# EAGLE schematic DZ60_Demoboard_V10_DLN18703 (EAGLE 9.6.2)

## Sheet 1 of 3
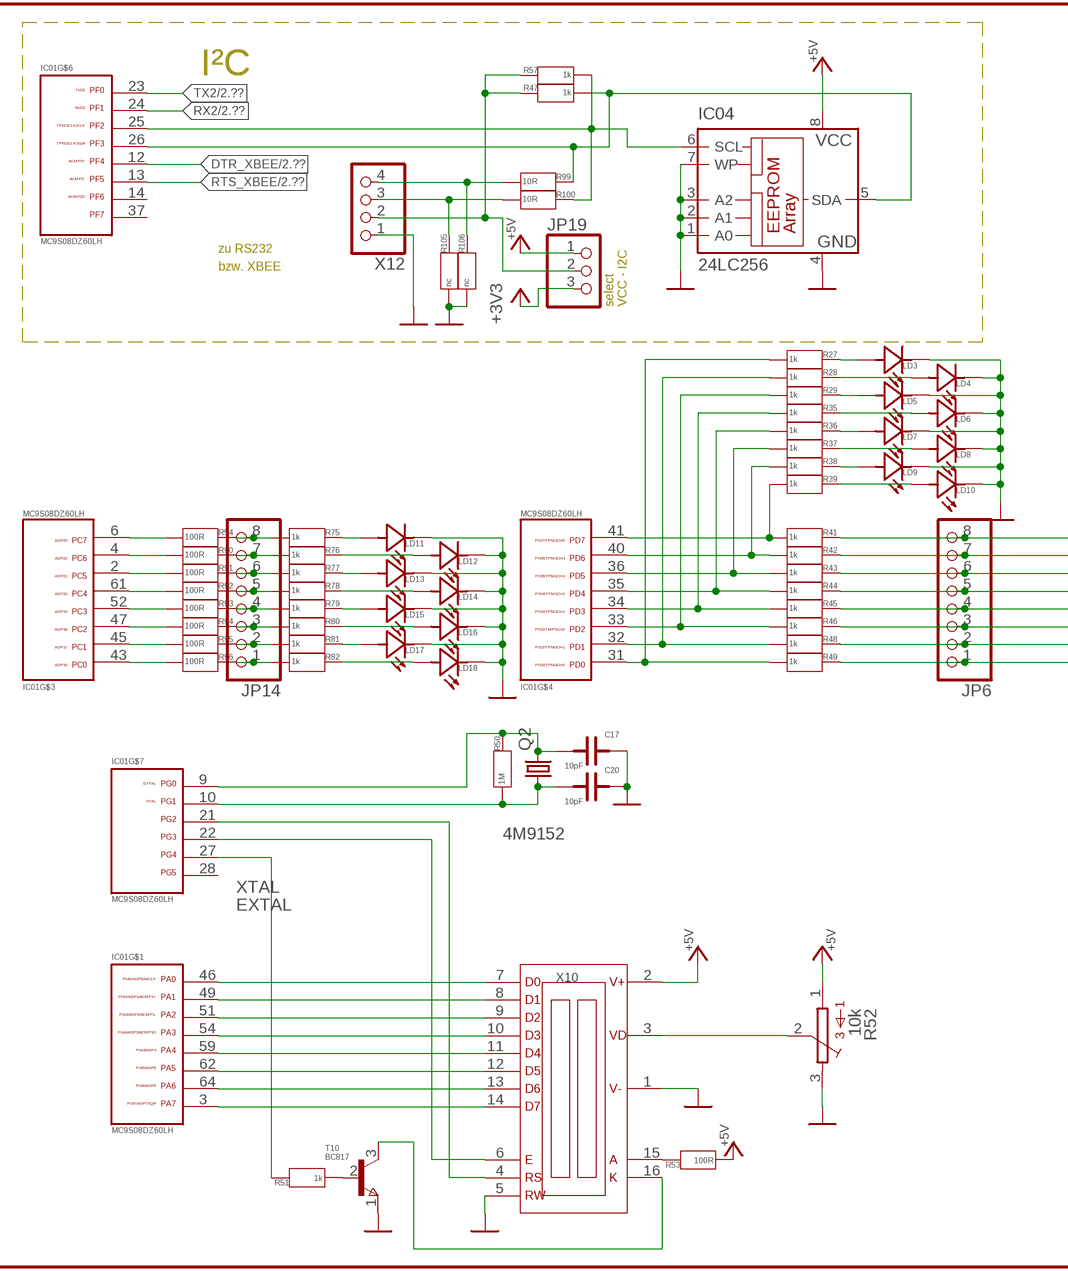
[diagram p0: schematic, sheet 1, part 1 of 2]
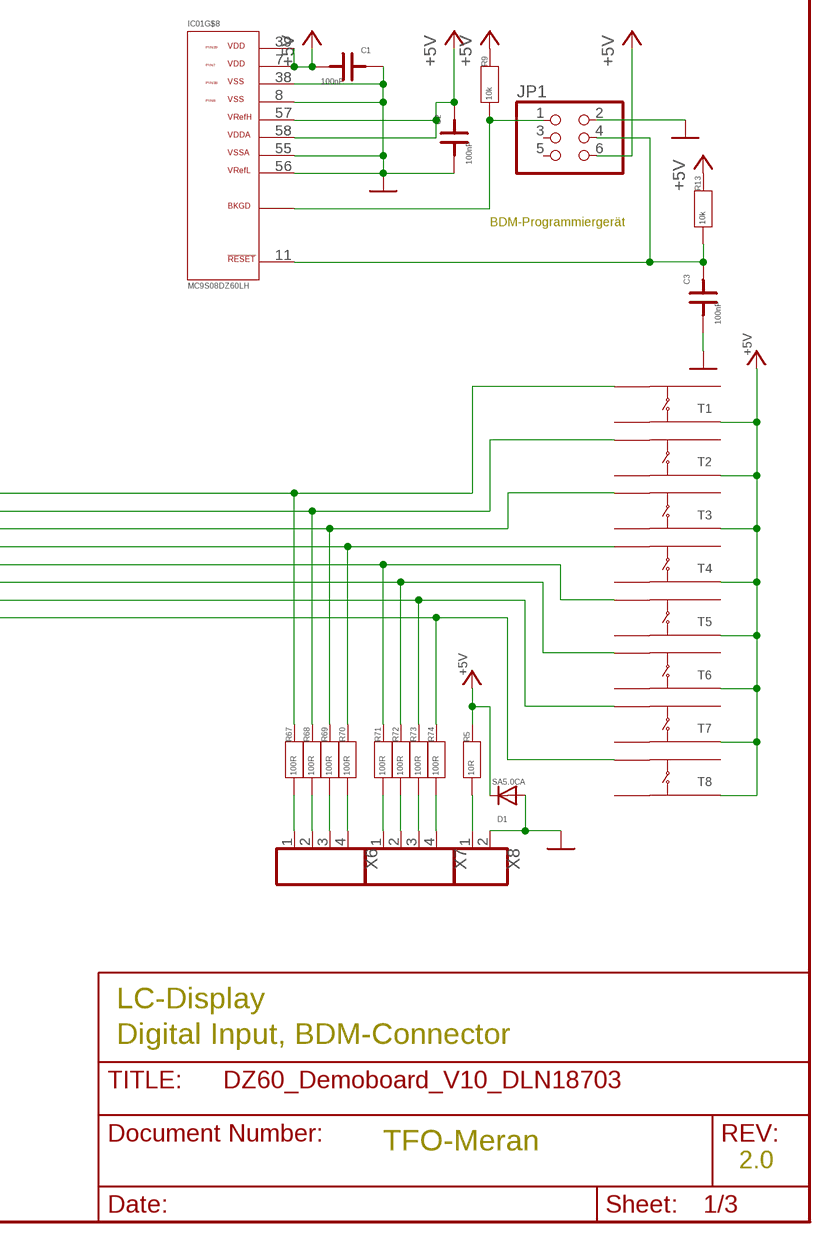
[diagram p1: schematic, sheet 1, part 2 of 2]

### Parts
C1  100nF  C1  [0805F]
C2  100nF  C1  [0805F]
C3  100nF  C1  [0805F]
C17  10pF  C1  [0805F]
C20  10pF  C1  [0805F]
D1  SA5.0CA  DIODE-SMB  [SMB]
IC01  MC9S08DZ60LH  [LQFP64]
IC04  24LC256  24CLC256SM  [SO-08M]
JP1  PINHD-2X3  [2X03]
JP6  PINHD-1X8  [1X08]
JP14  PINHD-1X8  [1X08]
JP19  PINHD-1X3  [1X03]
LD3  LEDSMD  [0805LED]
LD4  LEDSMD  [0805LED]
LD5  LEDSMD  [0805LED]
LD6  LEDSMD  [0805LED]
LD7  LEDSMD  [0805LED]
LD8  LEDSMD  [0805LED]
LD9  LEDSMD  [0805LED]
LD10  LEDSMD  [0805LED]
LD11  LEDSMD  [0805LED]
LD12  LEDSMD  [0805LED]
LD13  LEDSMD  [0805LED]
LD14  LEDSMD  [0805LED]
LD15  LEDSMD  [0805LED]
LD16  LEDSMD  [0805LED]
LD17  LEDSMD  [0805LED]
LD18  LEDSMD  [0805LED]
Q2  4M9152  HC49UP  [HC49UP]
R5  10R  R1  [0805]
R9  10k  R1  [0805]
R13  10k  R1  [0805]
R27  1k  R1  [0805]
R28  1k  R1  [0805]
R29  1k  R1  [0805]
R35  1k  R1  [0805]
R36  1k  R1  [0805]
R37  1k  R1  [0805]
R38  1k  R1  [0805]
R39  1k  R1  [0805]
R41  1k  R1  [0805]
R42  1k  R1  [0805]
R43  1k  R1  [0805]
R44  1k  R1  [0805]
R45  1k  R1  [0805]
R46  1k  R1  [0805]
R47  1k  R1  [0805]
R48  1k  R1  [0805]
R49  1k  R1  [0805]
R50  1M  R1  [0805]
R51  1k  R1  [0805]
R52  10k  S63X  [S63X]
R53  100R  R1  [0805]
R54  100R  R1  [0805]
R57  1k  R1  [0805]
R67  100R  R1  [0805]
R68  100R  R1  [0805]
R69  100R  R1  [0805]
R70  100R  R1  [0805]
R71  100R  R1  [0805]
R72  100R  R1  [0805]
R73  100R  R1  [0805]
R74  100R  R1  [0805]
R75  1k  R1  [0805]
R76  1k  R1  [0805]
R77  1k  R1  [0805]
R78  1k  R1  [0805]
R79  1k  R1  [0805]
R80  1k  R1  [0805]
R81  1k  R1  [0805]
R82  1k  R1  [0805]
R90  100R  R1  [0805]
R91  100R  R1  [0805]
R92  100R  R1  [0805]
R93  100R  R1  [0805]
R94  100R  R1  [0805]
R95  100R  R1  [0805]
R96  100R  R1  [0805]
R99  10R  R1  [0805]
R100  10R  R1  [0805]
R105  nc  R1  [0805]
R106  nc  R1  [0805]
T1  TASTERTHT  [TASTE_THT]
T2  TASTERTHT  [TASTE_THT]
T3  TASTERTHT  [TASTE_THT]
T4  TASTERTHT  [TASTE_THT]
T5  TASTERTHT  [TASTE_THT]
T6  TASTERTHT  [TASTE_THT]
T7  TASTERTHT  [TASTE_THT]
T8  TASTERTHT  [TASTE_THT]
T10  BC817  [SOT-23]
X6  KLEMME4  [KLEMME4]
X7  KLEMME4  [KLEMME4]
X8  KLEMME2  [KLEMME2]
X10  FDCC1602G  [FDCC1602G]
X12  MX254_4  [MX4]

### Nets
+3V3: JP19.3 ; also sheet 2,3
+5V: C1.1 C2.2 D1.C IC01.7(VDD_PIN7) IC01.39(VDD_PIN39) IC01.57(VREFH) IC01.58(VDDA) IC04.8(VCC) JP1.6 JP19.1 R5.2 R9.2 R13.2 R52.1 R53.1 T1.A1 T2.A1 T3.A1 T4.A1 T5.A1 T6.A1 T7.A1 T8.A1 X10.2(V+) ; also sheet 2,3
BKGD: IC01.42(BKGD) JP1.1 R9.1
D0: IC01.46(PA0) X10.7(D0)
D1: IC01.49(PA1) X10.8(D1)
D2: IC01.51(PA2) X10.9(D2)
D3: IC01.54(PA3) X10.10(D3)
D4: IC01.59(PA4) X10.11(D4)
D5: IC01.62(PA5) X10.12(D5)
D6: IC01.64(PA6) X10.13(D6)
D7: IC01.3(PA7) X10.14(D7)
DTR_XBEE: IC01.12(PF4) ; also sheet 2
E: IC01.22(PG3) X10.6(E)
EXTAL: C20.1 IC01.10(PG1) Q2.1 R50.1
GND: C1.2 C2.1 C3.1 C17.2 C20.2 D1.A IC01.8(VSS_PIN8) IC01.38(VSS_PIN38) IC01.55(VSSA) IC01.56(VREFL) IC04.1(A0) IC04.2(A1) IC04.3(A2) IC04.4(GND) IC04.7(WP) JP1.2 LD3.K LD4.K LD5.K LD6.K LD7.K LD8.K LD9.K LD10.K LD11.K LD12.K LD13.K LD14.K LD15.K LD16.K LD17.K LD18.K R52.3 R105.1 R106.1 T10.1(E) X8.2 X10.1(V-) X10.5(RW) X12.1 ; also sheet 2,3
LCD_LED1: IC01.27(PG4) R51.2
N$1: R53.2 X10.15(A)
N$14: LD11.A R75.2
N$15: LD12.A R76.2
N$24: LD3.A R27.2
N$25: LD4.A R28.2
N$26: LD5.A R29.2
N$27: LD6.A R35.2
N$29: LD7.A R36.2
N$31: LD8.A R37.2
N$32: LD9.A R38.2
N$33: LD10.A R39.2
N$39: R51.1 T10.2(B)
N$43: R5.1 X8.1
N$67: R52.2 X10.3(VD)
N$68: T10.3(C) X10.16(K)
N$72: LD13.A R77.2
N$73: LD14.A R78.2
N$74: LD15.A R79.2
N$75: LD16.A R80.2
N$76: LD17.A R81.2
N$77: LD18.A R82.2
PC0: JP14.1 R82.1 R96.2
PC0M: IC01.43(PC0) R96.1
PC1: JP14.2 R81.1 R95.2
PC1M: IC01.45(PC1) R95.1
PC2: JP14.3 R80.1 R94.2
PC2M: IC01.47(PC2) R94.1
PC3: JP14.4 R79.1 R93.2
PC3M: IC01.52(PC3) R93.1
PC4: JP14.5 R78.1 R92.2
PC4M: IC01.61(PC4) R92.1
PC5: JP14.6 R77.1 R91.2
PC5M: IC01.2(PC5) R91.1
PC6: JP14.7 R76.1 R90.2
PC6M: IC01.4(PC6) R90.1
PC7: JP14.8 R54.2 R75.1
PC7M: IC01.6(PC7) R54.1
PD0: JP6.1 R49.2 R74.2 T8.B2
PD0M: IC01.31(PD0) R27.1 R49.1
PD1: JP6.2 R48.2 R73.2 T7.B2
PD1M: IC01.32(PD1) R28.1 R48.1
PD2: JP6.3 R46.2 R72.2 T6.B2
PD2M: IC01.33(PD2) R29.1 R46.1
PD3: JP6.4 R45.2 R71.2 T5.B2
PD3M: IC01.34(PD3) R35.1 R45.1
PD4: JP6.5 R44.2 R70.2 T4.B2
PD4M: IC01.35(PD4) R36.1 R44.1
PD5: JP6.6 R43.2 R69.2 T3.B2
PD5M: IC01.36(PD5) R37.1 R43.1
PD6: JP6.7 R42.2 R68.2 T2.B2
PD6M: IC01.40(PD6) R38.1 R42.1
PD7: JP6.8 R41.2 R67.2 T1.B2
PD7M: IC01.41(PD7) R39.1 R41.1
PF0A: R74.1 X7.4
PF1A: R73.1 X7.3
PF2A: R72.1 X7.2
PF3A: R71.1 X7.1
PF4A: R70.1 X6.4
PF5A: R69.1 X6.3
PF6A: R68.1 X6.2
PF7A: R67.1 X6.1
RESET: C3.2 IC01.11(RST/) JP1.4 R13.1
RS: IC01.21(PG2) X10.4(RS)
RTS_XBEE: IC01.13(PF5) ; also sheet 2
RX2: IC01.24(PF1) ; also sheet 2
SCL_PF2: IC01.25(PF2) IC04.6(SCL) R57.1 R100.2
SCL_PIN: R100.1 R105.2 X12.3
SDA_PF3: IC01.26(PF3) IC04.5(SDA) R47.1 R99.2
SDA_PIN: R99.1 R106.2 X12.4
TX2: IC01.23(PF0) ; also sheet 2
U_I2C: JP19.2 R47.2 R57.2 X12.2
XTAL: C17.1 IC01.9(PG0) Q2.2 R50.2
Unconnected: IC01.14(PF6) IC01.28(PG5) IC01.37(PF7) JP1.3 JP1.5 T1.A2 T1.B1 T2.A2 T2.B1 T3.A2 T3.B1 T4.A2 T4.B1 T5.A2 T5.B1 T6.A2 T6.B1 T7.A2 T7.B1 T8.A2 T8.B1

### Notes on the sheet
- I²C
- zu RS232
- bzw. XBEE | BDM-Programmiergerät
- select | VCC - I2C
- LC-Display
- Digital Input, BDM-Connector
- TFO-Meran
- 2.0

## Sheet 2 of 3
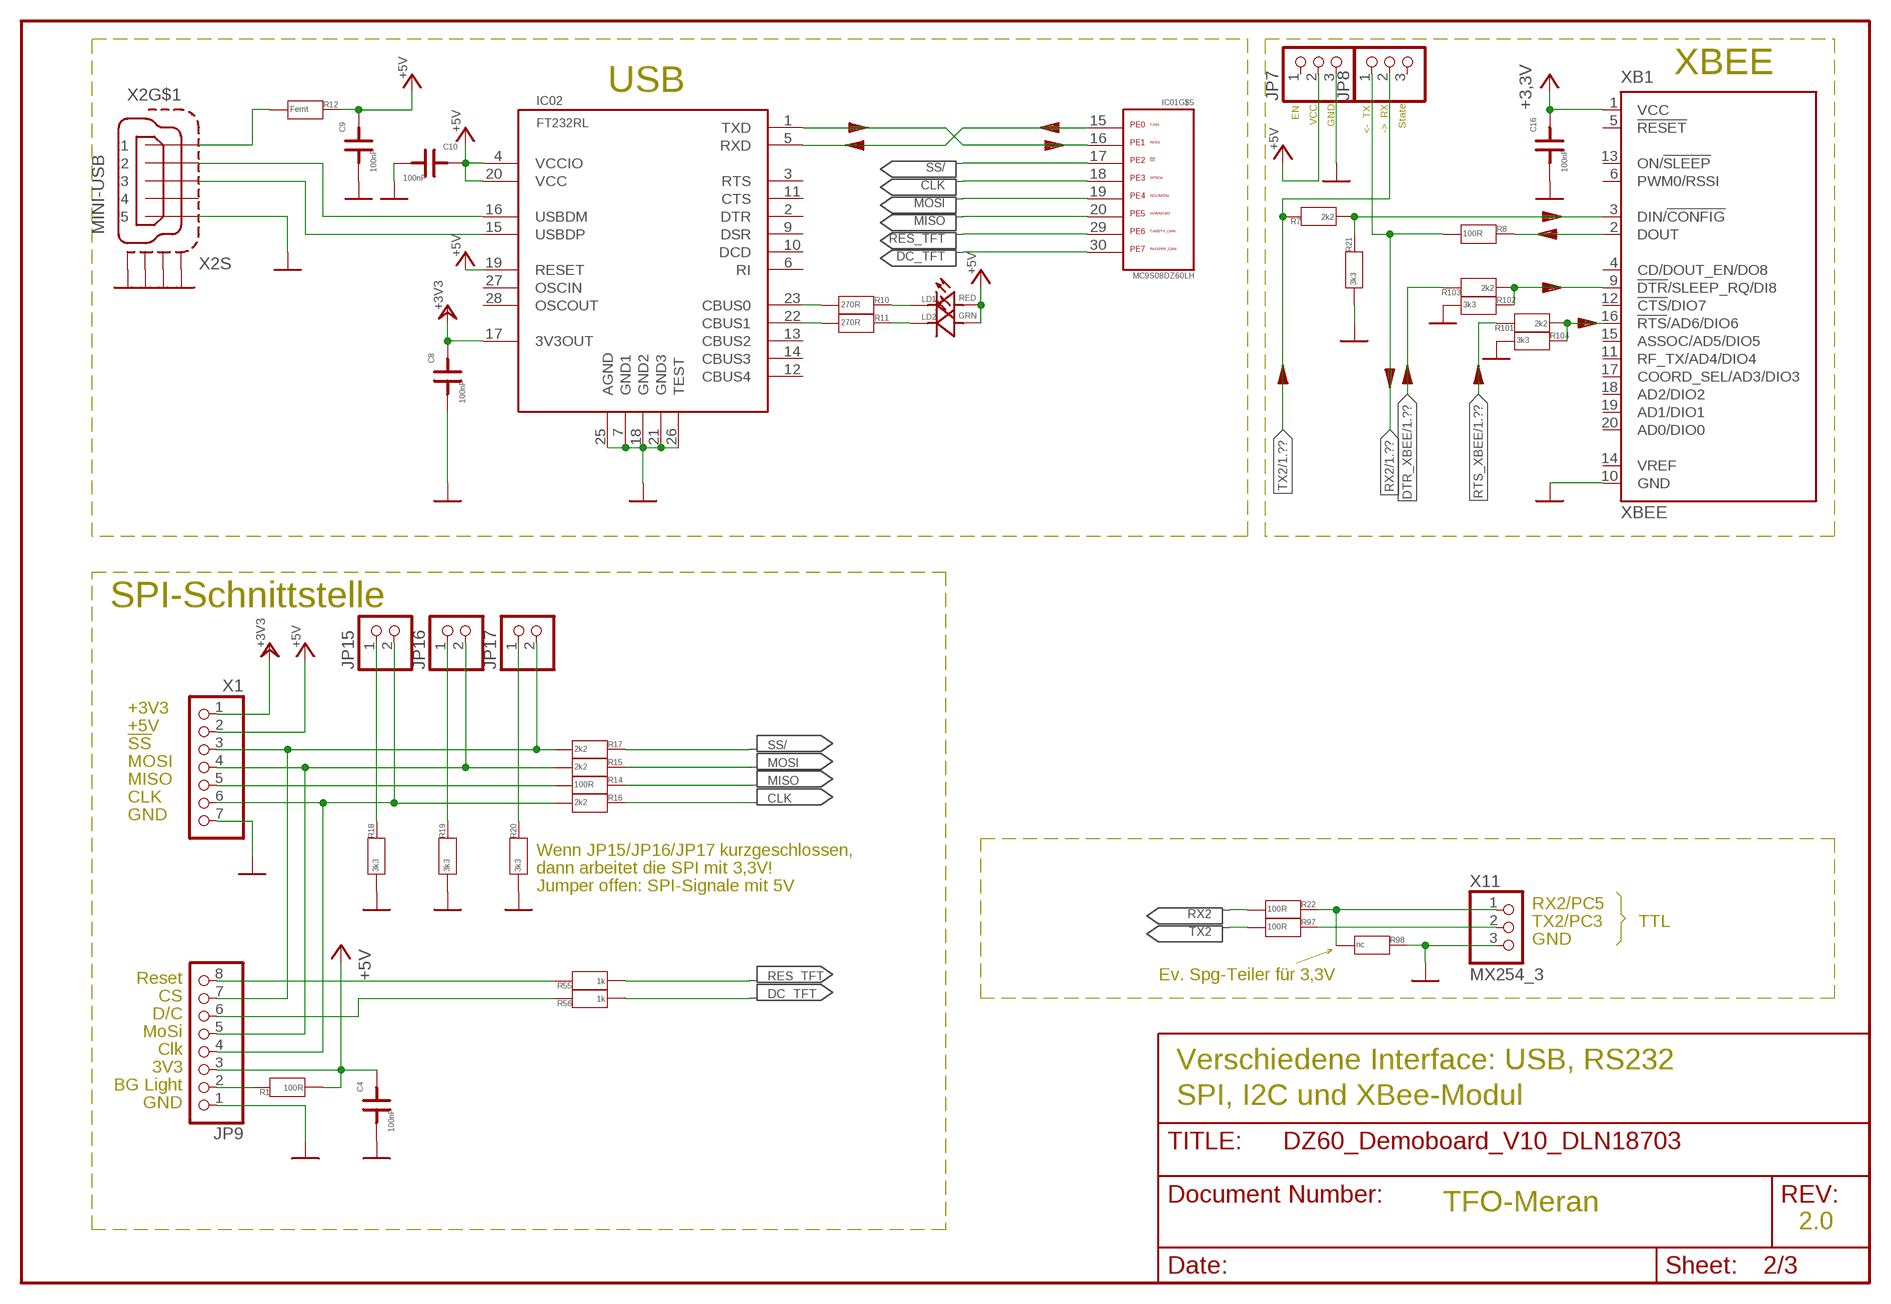
[diagram p2: schematic, sheet 2]

### Parts
C4  100nF  C1  [0805F]
C8  100nF  C1  [0805F]
C9  100nF  C1  [0805F]
C10  100nF  C1  [0805F]
C16  100nF  C1  [0805F]
IC02  FT232RL  FTDI232RL  [SSOP28]
JP7  PINHD-1X3  [1X03]
JP8  PINHD-1X3  [1X03]
JP9  PINHD-1X8  [1X08]
JP15  PINHD-1X2  [1X02]
JP16  PINHD-1X2  [1X02]
JP17  PINHD-1X2  [1X02]
LD1  RED  LEDSMD  [0805LED]
LD2  GRN  LEDSMD  [0805LED]
R1  100R  R1  [0805]
R7  2k2  R1  [0805]
R8  100R  R1  [0805]
R10  270R  R1  [0805]
R11  270R  R1  [0805]
R12  Ferrit  R2  [1206]
R14  100R  R1  [0805]
R15  2k2  R1  [0805]
R16  2k2  R1  [0805]
R17  2k2  R1  [0805]
R18  3k3  R1  [0805]
R19  3k3  R1  [0805]
R20  3k3  R1  [0805]
R21  3k3  R1  [0805]
R22  100R  R1  [0805]
R55  1k  R1  [0805]
R56  1k  R1  [0805]
R97  100R  R1  [0805]
R98  nc  R1  [0805]
R101  2k2  R1  [0805]
R102  3k3  R1  [0805]
R103  2k2  R1  [0805]
R104  3k3  R1  [0805]
X1  MX254_7  [MX7]
X2  MINI-USB  MINI-USB-SCHIELD-32005-201  [32005-201]
X11  MX254_3  [MX3]
XB1  XBEE  [XBEE]

### Nets
+3V3: C8.2 C16.2 IC02.17(3V3OUT) X1.1 XB1.1(VCC) ; supply symbol labelled +3,3V ; also sheet 1,3
+5V: C4.2 C9.2 C10.2 IC02.4(VCCIO) IC02.19(RESET) IC02.20(VCC) JP7.2 JP9.3 LD1.A LD2.A R1.1 R12.2 X1.2 ; also sheet 1,3
CLK: IC01.18(PE3) R16.2
DC_TFT: IC01.30(PE7) R56.1
DTR_XBEE: R103.2 ; also sheet 1
GND: C4.1 C8.1 C9.1 C10.1 C16.1 IC02.7(GND1) IC02.18(GND2) IC02.21(GND3) IC02.25(AGND) IC02.26(TEST) JP7.3 JP9.1 R18.1 R19.1 R20.1 R21.1 R98.2 R102.1 R104.1 X1.7 X2.5 X2.M1(S:S1) X2.M2(S:S2) X2.M3(S:S3) X2.M4(S:S4) X11.3 XB1.10(GND) ; also sheet 1,3
MISO: IC01.20(PE5) R14.2
MOSI: IC01.19(PE4) R15.2
N$2: LD1.K R10.2
N$3: R14.1 X1.5
N$5: IC02.23(CBUS0) R10.1
N$6: LD2.K R11.2
N$7: IC02.22(CBUS1) R11.1
N$13: JP9.8 R55.2
N$22: JP9.2 R1.2
N$28: JP9.4 JP15.2 R16.1 X1.6
N$30: JP9.7 JP17.2 R17.1 X1.3
N$35: JP9.6 R56.2
N$36: JP17.1 R20.2
N$37: JP16.1 R19.2
N$50: JP15.1 R18.2
N$51: JP9.5 JP16.2 R15.1 X1.4
N$78: R8.2 XB1.2(DOUT)
N$81: R7.1 R21.2 XB1.3(DIN/!CONFIG)
N$82: R101.1 R104.2 XB1.16(!RTS!/AD6/DIO6)
N$85: R102.2 R103.1 XB1.9(!DTR!/SLEEP_RQ/DI8)
RES_TFT: IC01.29(PE6) R55.1
RTS_XBEE: R101.2 ; also sheet 1
RX1: IC01.16(PE1) IC02.1(TXD)
RX2: JP8.1 R8.1 R22.1 ; also sheet 1
RX2_PINHEAD: R22.2 R98.1 X11.1
SS/: IC01.17(PE2) R17.2
TX1: IC01.15(PE0) IC02.5(RXD)
TX2: JP8.2 R7.2 R97.1 ; also sheet 1
TX2_PINHEAD: R97.2 X11.2
USB_1: R12.1 X2.1
USB_2: IC02.16(USBDM) X2.2
USB_3: IC02.15(USBDP) X2.3
Unconnected: IC02.2(DTR) IC02.3(RTS) IC02.6(RI) IC02.9(DSR) IC02.10(DCD) IC02.11(CTS) IC02.12(CBUS4) IC02.13(CBUS2) IC02.14(CBUS3) IC02.27(OSCIN) IC02.28(OSCOUT) JP7.1 JP8.3 X2.4 XB1.4(CD/DOUT_EN/DO8) XB1.5(!RESET) XB1.6(PWM0/RSSI) XB1.11(RF_TX/AD4/DIO4) XB1.12(!CTS!/DIO7) XB1.13(ON/!SLEEP) XB1.14(VREF) XB1.15(ASSOC/AD5/DIO5) XB1.17(COORD_SEL/AD3/DIO3) XB1.18(AD2/DIO2) XB1.19(AD1/DIO1) XB1.20(AD0/DIO0)

### Notes on the sheet
- XBEE
- USB
- EN | VCC | GND | <-  TX | ->  RX | State
- SPI-Schnittstelle
- +3V3
- +5V
- !SS
- MOSI
- MISO
- CLK
- GND
- Wenn JP15/JP16/JP17 kurzgeschlossen,
- dann arbeitet die SPI mit 3,3V!
- Jumper offen: SPI-Signale mit 5V
- RX2/PC5
- TX2/PC3 | TTL
- GND
- Reset | Ev. Spg-Teiler für 3,3V
- CS
- D/C
- MoSi
- Clk
- 3V3 | Verschiedene Interface: USB, RS232
- BG Light
- GND | SPI, I2C und XBee-Modul
- TFO-Meran
- 2.0

## Sheet 3 of 3
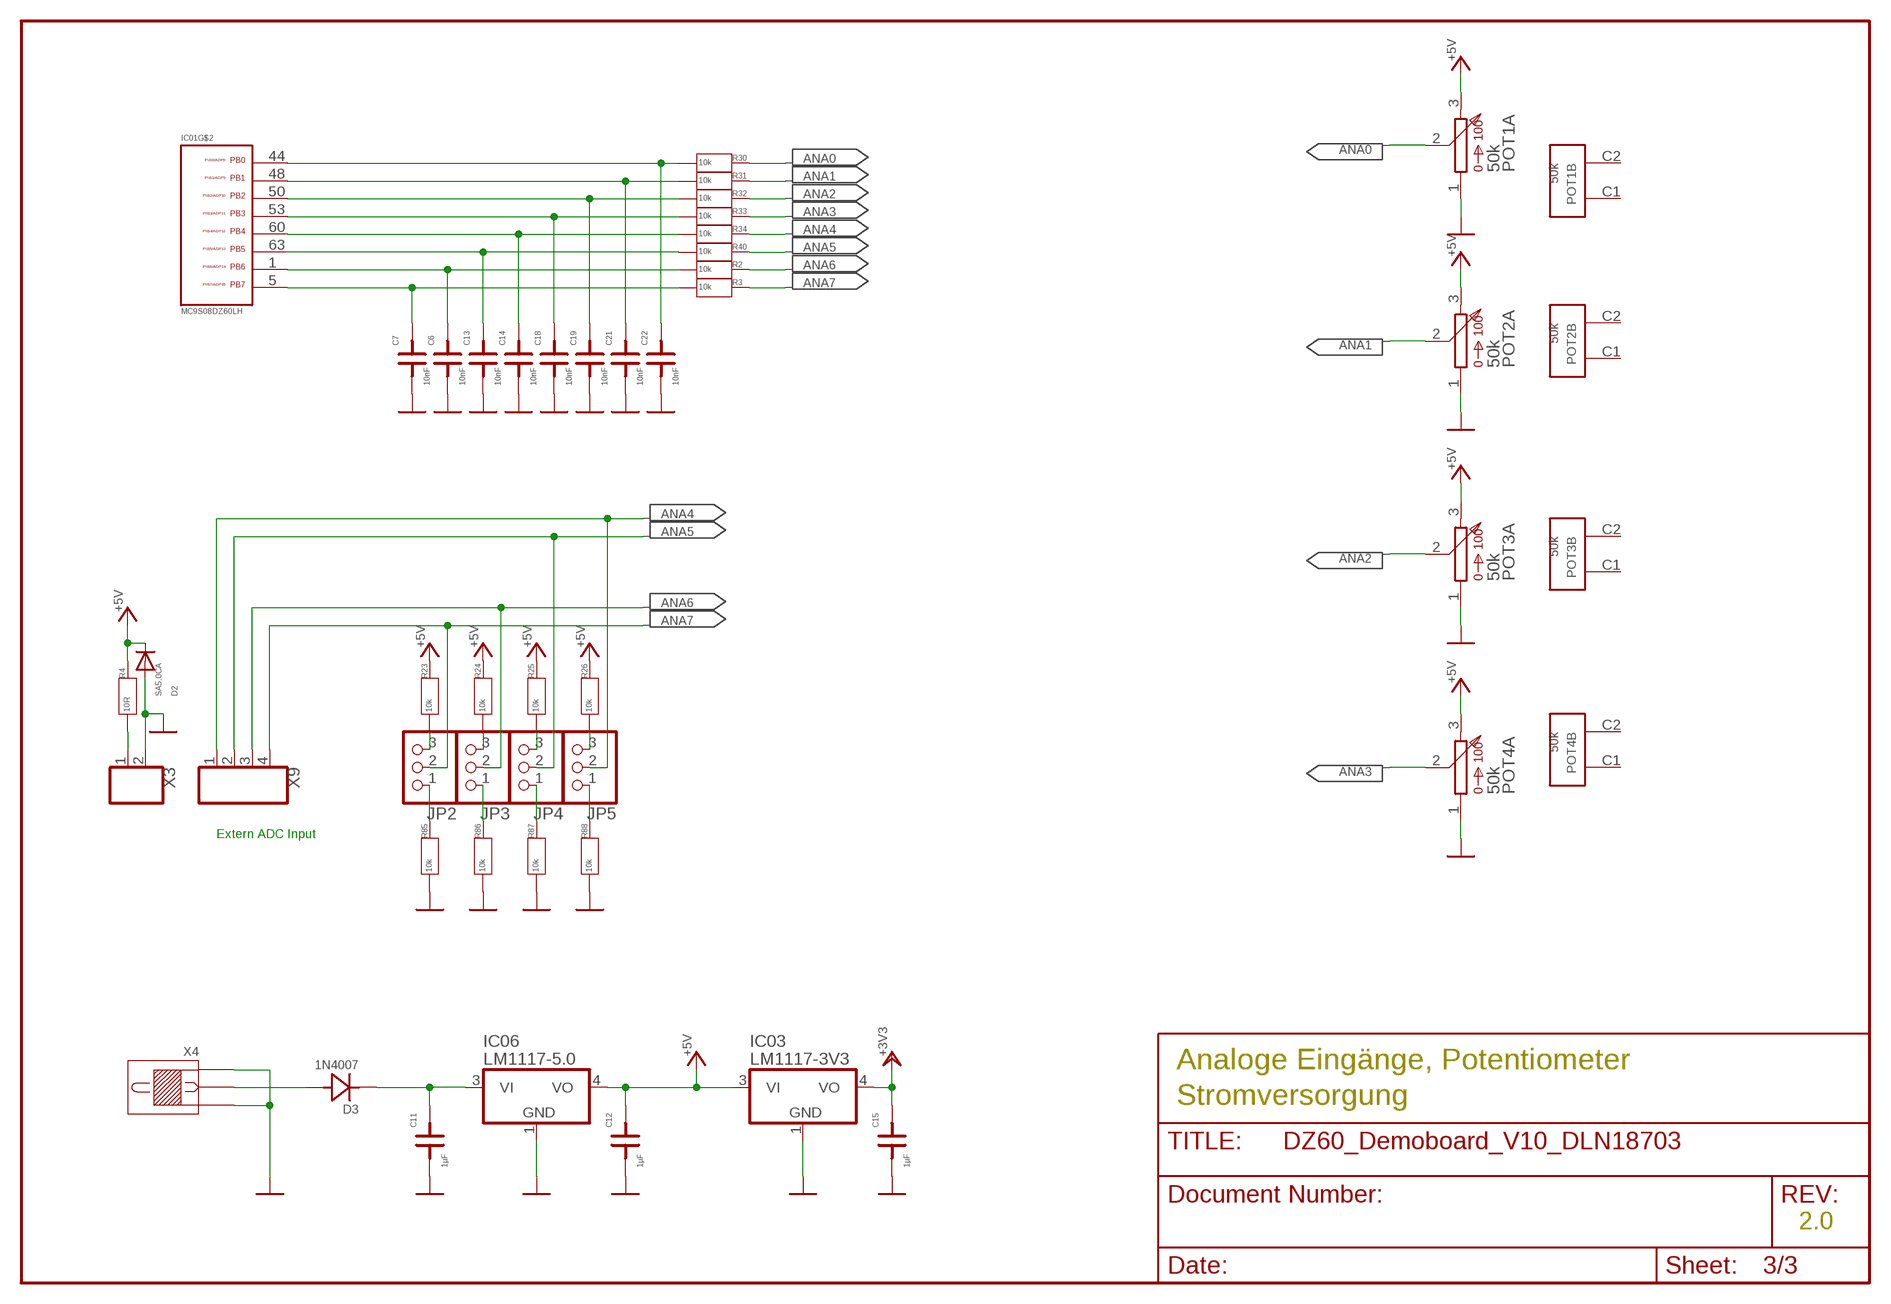
[diagram p3: schematic, sheet 3]

### Parts
C6  10nF  C1  [0805F]
C7  10nF  C1  [0805F]
C11  1µF  C1  [0805F]
C12  1µF  C1  [0805F]
C13  10nF  C1  [0805F]
C14  10nF  C1  [0805F]
C15  1µF  C1  [0805F]
C18  10nF  C1  [0805F]
C19  10nF  C1  [0805F]
C21  10nF  C1  [0805F]
C22  10nF  C1  [0805F]
D2  SA5.0CA  DIODE-SMB  [SMB]
D3  1N4007  DHCMELF  [MELF_B]
IC03  LM1117-3V3  LM1117DT  [DPAK]
IC06  LM1117-5.0  LM1117DT  [DPAK]
JP2  PINHD-1X3  [1X03]
JP3  PINHD-1X3  [1X03]
JP4  PINHD-1X3  [1X03]
JP5  PINHD-1X3  [1X03]
POT1  50k  ALPSVERT  [ALPS_VERTICAL]
POT2  50k  ALPSVERT  [ALPS_VERTICAL]
POT3  50k  ALPSVERT  [ALPS_VERTICAL]
POT4  50k  ALPSVERT  [ALPS_VERTICAL]
R2  10k  R1  [0805]
R3  10k  R1  [0805]
R4  10R  R1  [0805]
R23  10k  R1  [0805]
R24  10k  R1  [0805]
R25  10k  R1  [0805]
R26  10k  R1  [0805]
R30  10k  R1  [0805]
R31  10k  R1  [0805]
R32  10k  R1  [0805]
R33  10k  R1  [0805]
R34  10k  R1  [0805]
R40  10k  R1  [0805]
R85  10k  R1  [0805]
R86  10k  R1  [0805]
R87  10k  R1  [0805]
R88  10k  R1  [0805]
X3  KLEMME2  [KLEMME2]
X4  SPP  [SPP]
X9  KLEMME4  [KLEMME4]

### Nets
+3V3: C15.2 IC03.4(VO) ; also sheet 1,2
+5V: C12.2 D2.C IC03.3(VI) IC06.4(VO) POT1.3 POT2.3 POT3.3 POT4.3 R4.2 R23.2 R24.2 R25.2 R26.2 ; also sheet 1,2
ADCPB0: C22.2 IC01.44(PB0) R30.1
ADCPB1: C21.2 IC01.48(PB1) R31.1
ADCPB2: C19.2 IC01.50(PB2) R32.1
ADCPB3: C18.2 IC01.53(PB3) R33.1
ADCPB4: C14.2 IC01.60(PB4) R34.1
ADCPB5: C13.2 IC01.63(PB5) R40.1
ADCPB6: C6.2 IC01.1(PB6) R2.1
ADCPB7: C7.2 IC01.5(PB7) R3.1
ANA0: POT1.2 R30.2
ANA1: POT2.2 R31.2
ANA2: POT3.2 R32.2
ANA3: POT4.2 R33.2
ANA4: JP5.2 R34.2 X9.1
ANA5: JP4.2 R40.2 X9.2
ANA6: JP3.2 R2.2 X9.3
ANA7: JP2.2 R3.2 X9.4
GND: C6.1 C7.1 C11.1 C12.1 C13.1 C14.1 C15.1 C18.1 C19.1 C21.1 C22.1 D2.A IC03.1(GND) IC06.1(GND) POT1.1 POT2.1 POT3.1 POT4.1 R85.1 R86.1 R87.1 R88.1 X3.2 X4.1 X4.3 ; also sheet 1,2
N$53: R4.1 X3.1
N$70: C11.2 D3.K IC06.3(VI)
N$71: D3.A X4.2
N$89: JP5.3 R26.1
N$96: JP4.3 R25.1
N$97: JP3.3 R24.1
N$98: JP2.3 R23.1
N$99: JP2.1 R85.2
N$100: JP3.1 R86.2
N$101: JP4.1 R87.2
N$102: JP5.1 R88.2
Unconnected: POT1.C1(B:C1) POT1.C2(B:C2) POT2.C1(B:C1) POT2.C2(B:C2) POT3.C1(B:C1) POT3.C2(B:C2) POT4.C1(B:C1) POT4.C2(B:C2)

### Notes on the sheet
- Extern ADC Input
- Analoge Eingänge, Potentiometer
- Stromversorgung
- 2.0

## Library data of the parts
C1-C4 C6-C22 = deto:C
D1 D2 = diode:DIODE-: DIODE
D3 = deto:DHC: Hii-Curr-Diode, Silizium, Typ Gleichrichter z.B. wie 1N4007 oder ähnlich
IC01 = NXP_Controller_Deto:MC9S08DZ60
IC02 = deto2:FTDI232: FT232R USB zu RS232 Konverter von FTDI www.ftdichip.com
IC03 IC06 = deto:LM1117: Spannungsregler Fix oder einstellbar LM1117XX-YY wobei XX die Gehäuseform angibt (DT = Dpak) und YY die Spannung angibt (z.B. 5.0 für 5V oder ADJ für einstellbar)
IC04 = microchip:24C*: Serial EEPROM 1 K/2 K/4 K
JP1 = pinhead:PINHD-2X3
JP2-JP5 JP7 JP8 JP19 = pinhead:PINHD-1X3
JP6 JP9 JP14 = pinhead:PINHD-1X8
JP15-JP17 = pinhead:PINHD-1X2
LD1-LD18 = deto:LED: Led´s in allen Formen
POT1-POT4 = pot:ALPS
Q2 = crystal:HC49UP: CRYSTAL
R1-R5 R7-R51 R53-R57 R67-R82 R85-R88 R90-R106 = deto:R: Widerstand 400 mil - 0805 - 1206
R52 = pot:S63X: POTENTIOMETER
T1-T8 = deto:TASTER: Taste SMD, Typ DIPTRONICS DTSM-644K Distrelec-Best.Nr: 200312
T10 = deto:BC817
X1 = CONNECT:MX254_7: MX254_7 connector; Adimpex code: ITK40407
X2 = con-cypressindustries:MINI-USB-SCHIELD-: MINI USB-B Conector Source: www.cypressindustries.com; OC_FARNELL: unknown; OC_NEWARK: unknown
X3 X8 = CONNECT:KLEMME2
X4 = CONNECT:SPP
X6 X7 X9 = CONNECT:KLEMME4
X10 = DISP-LCD:FDCC1602: LCD 2x16 Zeichen FDCC1602_x_FLYYBWJ Fordatata, wobei das "x" durch das Variant ersetzt wird! www.fordata.com
X11 = CONNECT:MX254_3
X12 = CONNECT:MX254_4: MX254_4 Connector, Adimpex code: ITK40404
XB1 = maxstream:XBEE: XBee (TM) /XBee-PRO(TM) OEM RF Modules Source: MaxStream, Inc. xbee_productmanual.pdf; MPN: XBP24-Z7UIT-004; OC_FARNELL: 1751799; OC_NEWARK: 34R5507